# Altium project Sensor.PrjPcb
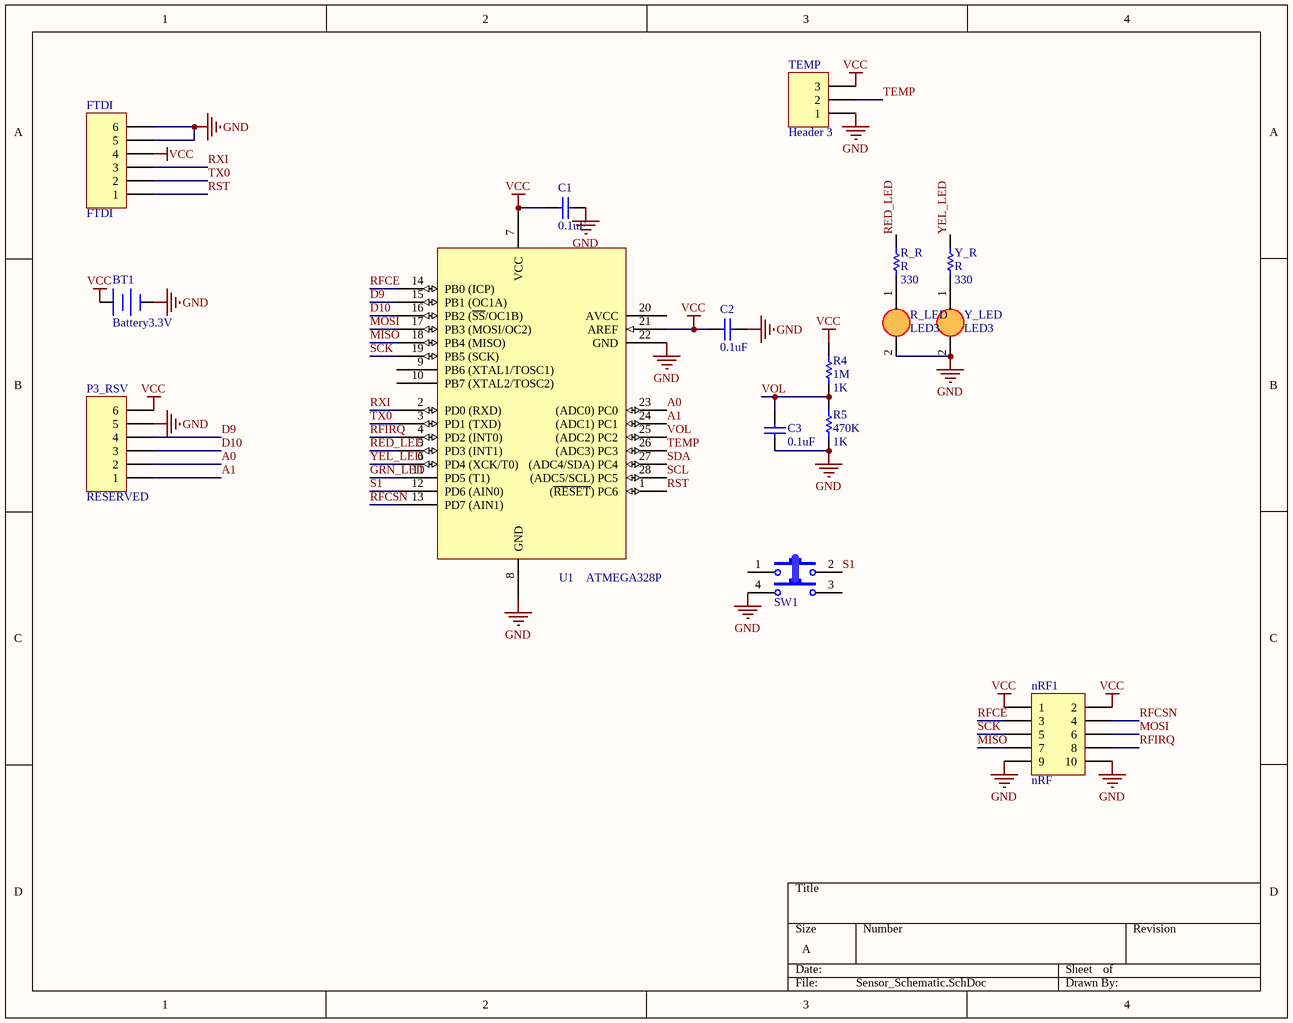
[diagram p0: Sensor_Schematic.SchDoc]
1 sheet, 16 parts. Net scope: global (net labels, ports and power ports of the same name join across sheets).
Board file: Sensor_PCB.PcbDoc

## Sheet Sensor_Schematic.SchDoc
size A

### Parts
BT1  Battery3.3V  [CR2032 Holder]
C1  value 0.1uF  [Tu-pico]  (hidden comment: Capacitor Ceramic)
C2  value 0.1uF  [Tu-pico]  (hidden comment: Capacitor Ceramic)
C3  value 0.1uF  [Tu-pico]  (hidden comment: Capacitor Ceramic)
FTDI  FTDI  [HDR1X6]
nRF1  nRF  [HDR2X5]
P3_RSV  RESERVED  [HDR1X6]
R4  1M  value 1K  [AXIAL-0.3]
R5  470K  value 1K  [AXIAL-0.3]
R_LED  LED3  [LED3mm]
R_R  R  value 330  [AXIAL-0.3]
SW1  SW-4P-B  [SW-4P-B]  (value not drawn)
TEMP  Header 3  [HDR1X3]
U1  ATMEGA328P  [AVR_DIP28P]
Y_LED  LED3  [LED3mm]
Y_R  R  value 330  [AXIAL-0.3]

### Nets
GND: BT1.2(-) C1.2 C2.2 C3.1 FTDI.5 FTDI.6 nRF1.9 nRF1.10 P3_RSV.5 R5.1 R_LED.2(K) SW1.4 TEMP.1 U1.8(GND) U1.22(GND) Y_LED.2(K)
VCC: BT1.1(+) C1.1 C2.1 FTDI.4 nRF1.1 nRF1.2 P3_RSV.6 R4.2 TEMP.3 U1.7(VCC) U1.21(AREF)
A0: P3_RSV.2 U1.23((ADC0)_PC0)
A1: P3_RSV.1 U1.24((ADC1)_PC1)
D9: P3_RSV.4 U1.15(PB1_(OC1A))
D10: P3_RSV.3 U1.16(PB2_(~{SS}/OC1B))
GRN_LED: U1.11(PD5_(T1))
MISO: nRF1.7 U1.18(PB4_(MISO))
MOSI: nRF1.6 U1.17(PB3_(MOSI/OC2))
RED_LED: R_R.2 U1.5(PD3_(INT1))
RFCE: nRF1.3 U1.14(PB0_(ICP))
RFCSN: nRF1.4 U1.13(PD7_(AIN1))
RFIRQ: nRF1.8 U1.4(PD2_(INT0))
RST: FTDI.1 U1.1((~{RESET})_PC6)
RXI: FTDI.3 U1.2(PD0_(RXD))
S1: SW1.2 U1.12(PD6_(AIN0))
SCK: nRF1.5 U1.19(PB5_(SCK))
SCL: U1.28((ADC5/SCL)_PC5)
SDA: U1.27((ADC4/SDA)_PC4)
TEMP: TEMP.2 U1.26((ADC3)_PC3)
TX0: FTDI.2 U1.3(PD1_(TXD))
VOL: C3.2 R4.1 R5.2 U1.25((ADC2)_PC2)
YEL_LED: U1.6(PD4_(XCK/T0)) Y_R.2
NetR_LED_1: R_LED.1(A) R_R.1
NetY_LED_1: Y_LED.1(A) Y_R.1

Not connected (* = marked no-connect by the designer): SW1 1 3; U1 9(PB6_(XTAL1/TOSC1)) 10(PB7_(XTAL2/TOSC2)) 20(AVCC)

### Library data of the parts
BT1 = Battery3.3V: Multicell Battery; Published: 24-Mar-1999; LatestRevisionDate: 17-Jul-2002; LatestRevisionNote: Re-released for DXP Platform.; PackageReference: BAT-2; Publisher: Altium Limited
C1-C3 = CapCeramic: Capacitor; Published: 8-Jun-2000; LatestRevisionDate: 17-Jul-2002; LatestRevisionNote: Re-released for DXP Platform.; PackageReference: RAD-0.3; Publisher: Altium Limited
FTDI P3_RSV = Header 6: Header, 6-Pin; LatestRevisionDate: 17-Jul-2002; LatestRevisionNote: Re-released for DXP Platform.; Publisher: Altium Limited
nRF1 = Header 5X2: Header, 5-Pin, Dual row; LatestRevisionDate: 17-Jul-2002; LatestRevisionNote: Re-released for DXP Platform.; Publisher: Altium Limited
R4 R5 R_R Y_R = Res1: Resistor; Published: 8-Jun-2000; LatestRevisionDate: 17-Jul-2002; LatestRevisionNote: Re-released for DXP Platform.; PackageReference: AXIAL-0.3; Publisher: Altium Limited; PackageDescription: Axial Device, Thru-Hole; 2 Leads; 0.3 in Pin Spacing
R_LED Y_LED = LED 3mm
SW1 = SW-4PIN-BIG: Switch Big 4 Pin; Published: 24-Mar-1999; LatestRevisionDate: 17-Jul-2002; LatestRevisionNote: Re-released for DXP Platform.; PackageReference: SPST-2; Publisher: Altium Limited
TEMP = Header 3: Header, 3-Pin; LatestRevisionDate: 17-Jul-2002; LatestRevisionNote: Re-released for DXP Platform.; Publisher: Altium Limited
U1 = ATMEGA8_DIP28: Atmel Microcontroller - Library created by carel..  <www.mpfreezone.com>